# Altium schematic sheet Схемотехника.SchDoc
size 500 x 500 mm
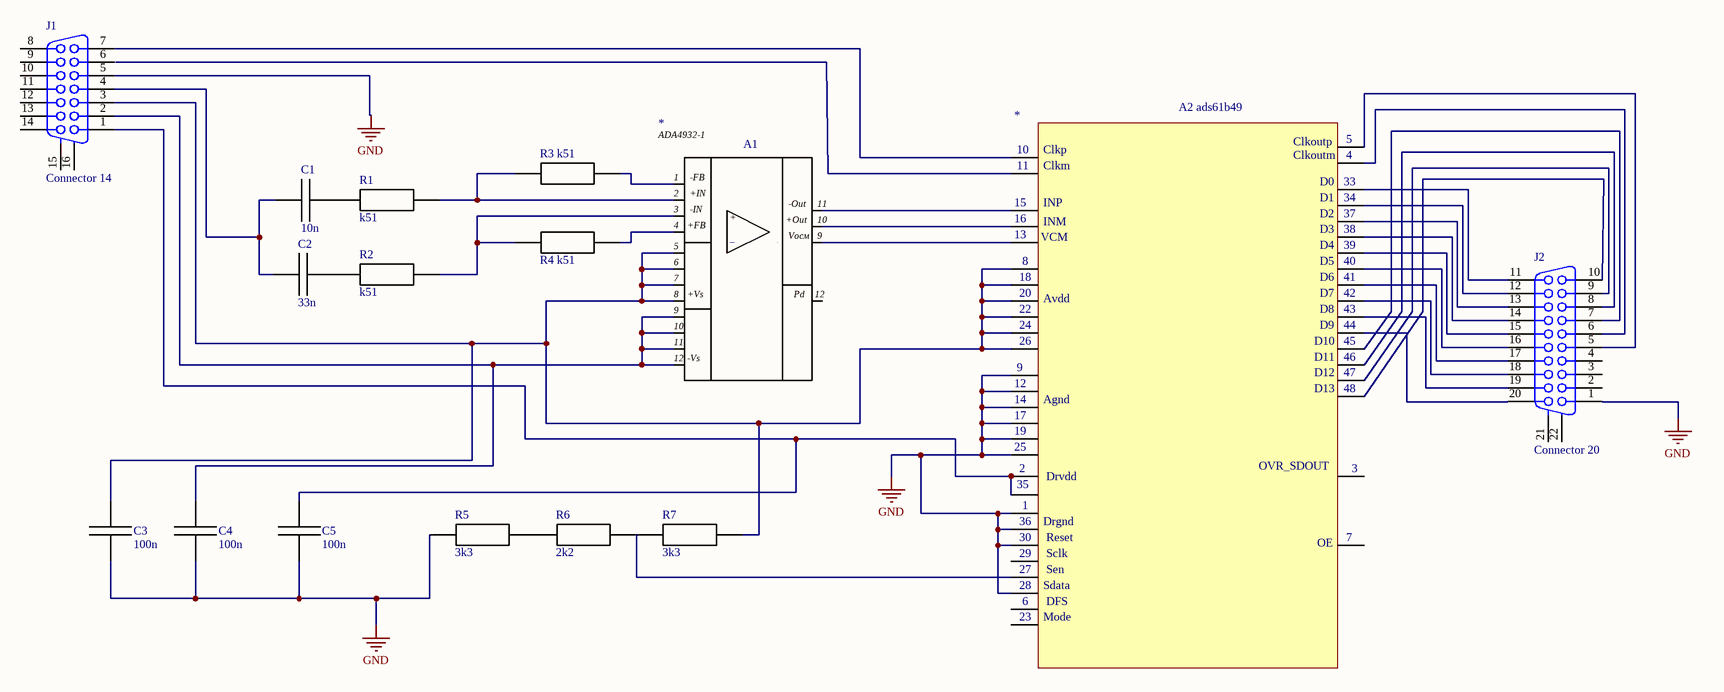
[diagram p0: Схемотехника.SchDoc]

## Parts
(Parts that share a designator on the sheet are numbered #1, #2 ... from top to bottom, then left to right.)
*#1  A1
*#2  A2 ads61b49
?  R4 k51
C1  10n
C2  33n
C3  100n
C4  100n
C5  100n
J1  Connector 14  [CHAMP1.27-2H14A]
J2  Connector 20  [CHAMP1.27-2H20]
R1  k51
R2  k51
R3_k51  (no value)
R5  3k3
R6  2k2
R7  3k3

## Nets
GND: *#2.1 *#2.9 *#2.12 *#2.14 *#2.17 *#2.19 *#2.25 *#2.28 *#2.30 *#2.36 C3.2 C4.2 C5.2 J1.5 J2.1 R5.4
Net*#1_30: *#1.30 R3_k51.4
Net*#1_31: *#1.31 R1.4
Net*#1_32: *#1.32 R2.4
Net*#1_32: *#1.32 *#2.16  [a separate net that carries the same name]
Net*#1_33: *#1.33 ?.4
Net*#1_34: *#1.34 *#1.35 *#1.36 *#1.37 *#2.8 *#2.18 *#2.20 *#2.22 *#2.24 *#2.26 C3.3 J1.3
Net*#1_38: *#1.38 *#1.39 *#1.40 *#1.41 C4.3 J1.2
Net*#1_42: *#1.42 *#2.13
Net*#1_43: *#1.43 *#2.15
Net*#2_2: *#2.2 *#2.35 C5.3 J1.1
Net*#2_4: *#2.4 J2.6
Net*#2_5: *#2.5 J2.5
Net*#2_10: *#2.10 J1.7
Net*#2_11: *#2.11 J2.10
Net*#2_27: *#2.27 R7.4
Net*#2_33: *#2.33 J2.11
Net*#2_34: *#2.34 J2.12
Net*#2_37: *#2.37 J2.13
Net*#2_38: *#2.38 J2.14
Net*#2_39: *#2.39 J2.15
Net*#2_40: *#2.40 J2.16
Net*#2_41: *#2.41 J2.17
Net*#2_42: *#2.42 J2.18
Net*#2_43: *#2.43 J2.19
Net*#2_44: *#2.44 J2.20
Net*#2_45: *#2.45 J2.7
Net*#2_46: *#2.46 J2.8
Net*#2_47: *#2.47 J2.9
NetC1_2: C1.2 C2.2 J1.4

Not connected (* = marked no-connect by the designer): *#1 12 44; *#2 3 6 7 23 29; ? 5; C1 3; C2 3; J1 6 8 9 10 11 12 13 14 15(MH1) 16(MH2); J2 2 3 4 21(MH1) 22(MH2); R1 5; R2 5; R3_k51 5; R5 5; R6 4 5; R7 5

## Notes on the sheet
- (in symbol ACP 14-byt) Clkoutp; Clkp; Clkoutm; Clkm; D0; D1; INP; D2; INM; D3; VCM; D4; D5; D6; D7; Avdd; D8; D9; D10; D11; D12; D13; Agnd; OVR_SDOUT; Drvdd; Drgnd; Reset; OE; Sclk; Sen; Sdata; DFS; Mode
- (in symbol OU ADA4932-1) ADA4932-1; 1; -FB; 2; +IN; -Out; 11; 3; -IN; +; +Out; 10; 4; +FB; _; Vосм; 9; 5; 6; 7; 8; +Vs; Pd; -Vs

## Library data of the parts
*#1 = OU ADA4932-1
*#2 = ACP 14-byt
? R1 R2 R3_k51 R5-R7 = Res
C1-C5 = Cond
J1 = Connector 14: Receptacle Header Assemby; PackageDocument: B; Positions: 14; Published: 15-Jun-2001; LatestRevisionDate: 17-Jul-2002; LatestRevisionNote: Re-released for DXP Platform.; DatasheetDocument: 1-Oct-1983; PackageReference: 178240-1; Publisher: Altium Limited; Orientation: Right Angle
J2 = Connector 20: Receptacle Header Assemby; PackageDocument: B; Positions: 20; Published: 15-Jun-2001; LatestRevisionDate: 17-Jul-2002; LatestRevisionNote: Re-released for DXP Platform.; DatasheetDocument: 1-Oct-1983; PackageReference: 178240-2; Publisher: Altium Limited; Orientation: Right Angle